# EAGLE design RH020.1 (EAGLE 7.1.0)
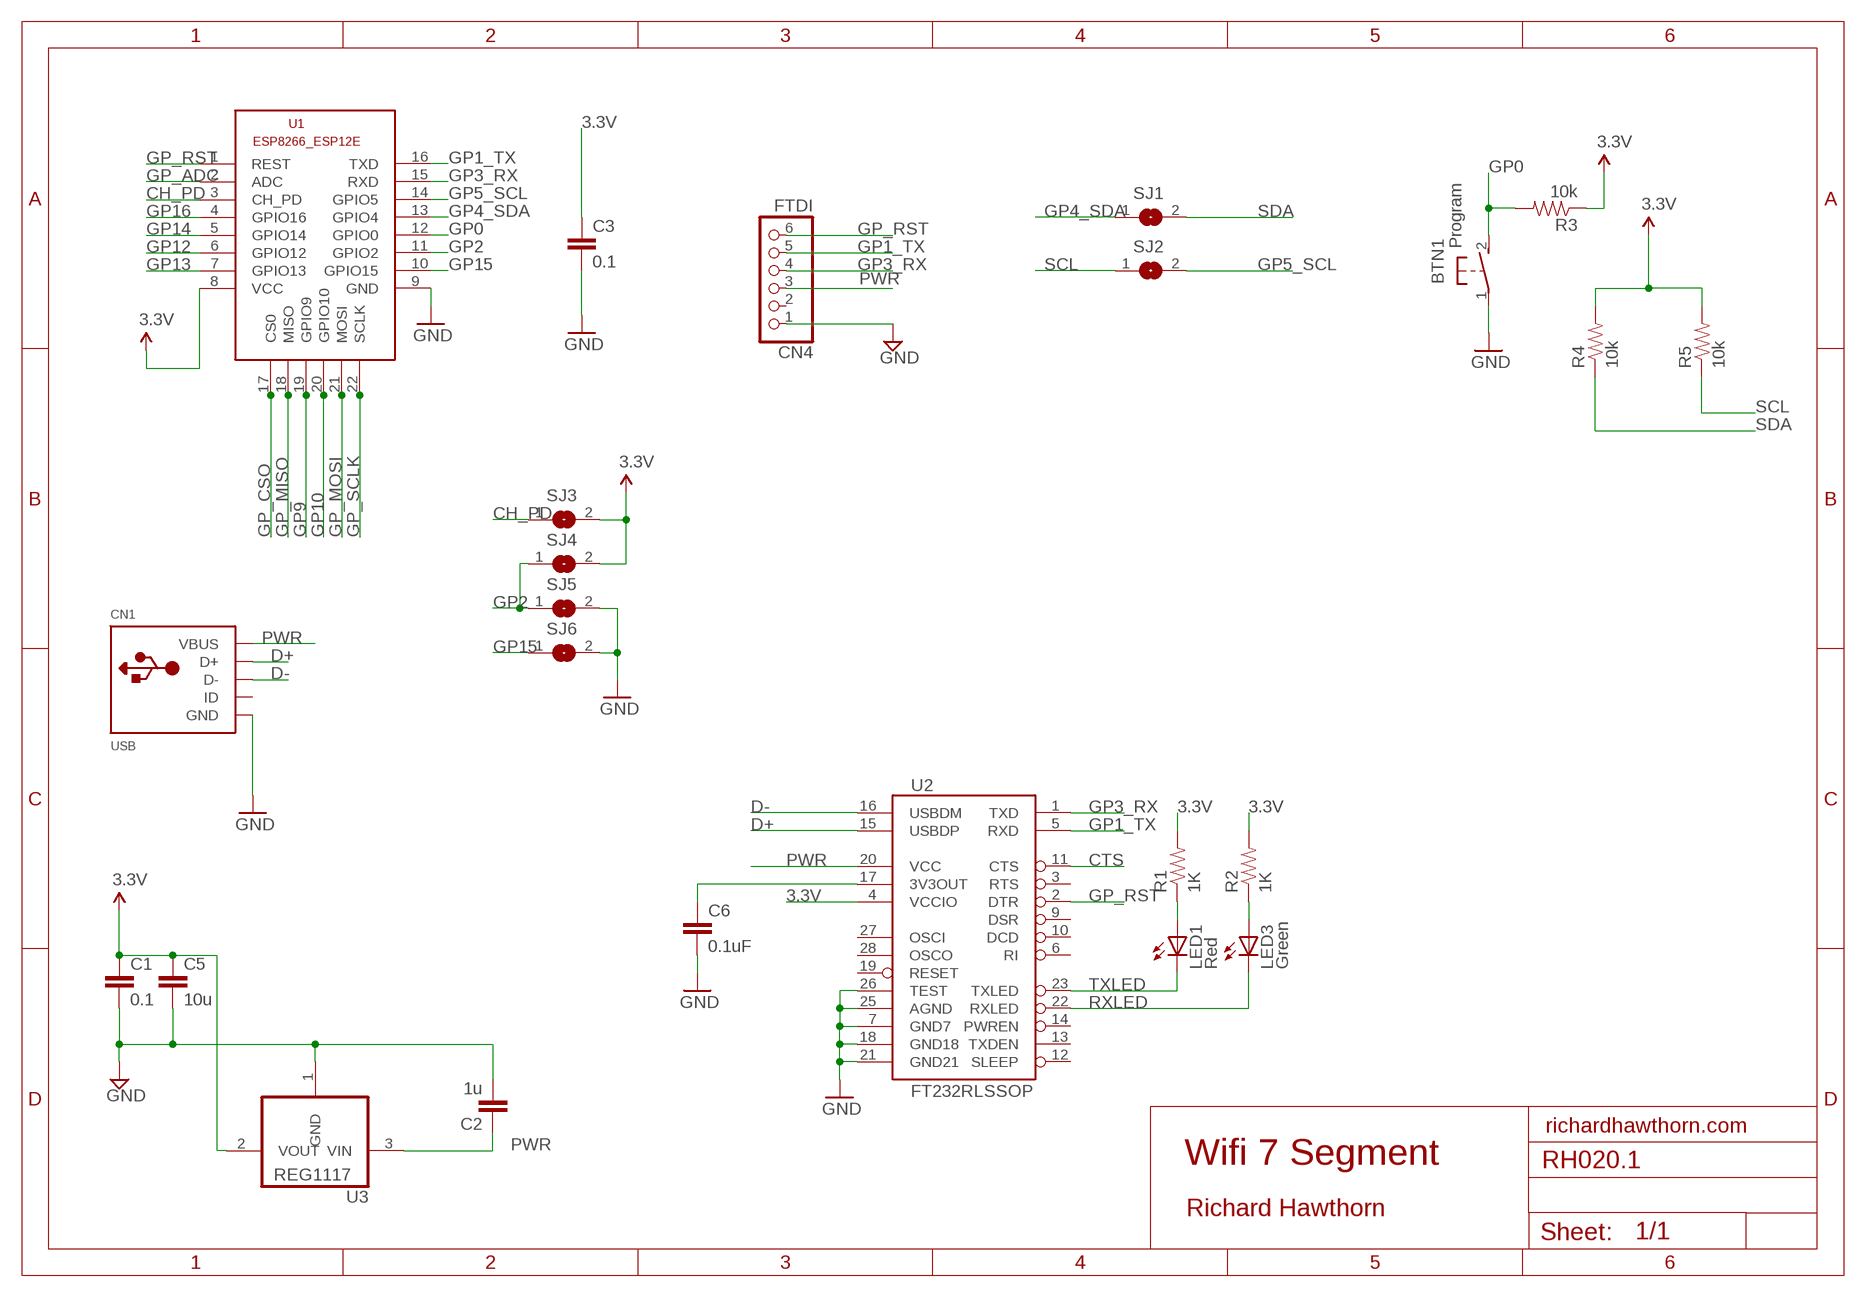
[diagram p0: schematic, sheet 1, part 1 of 2]
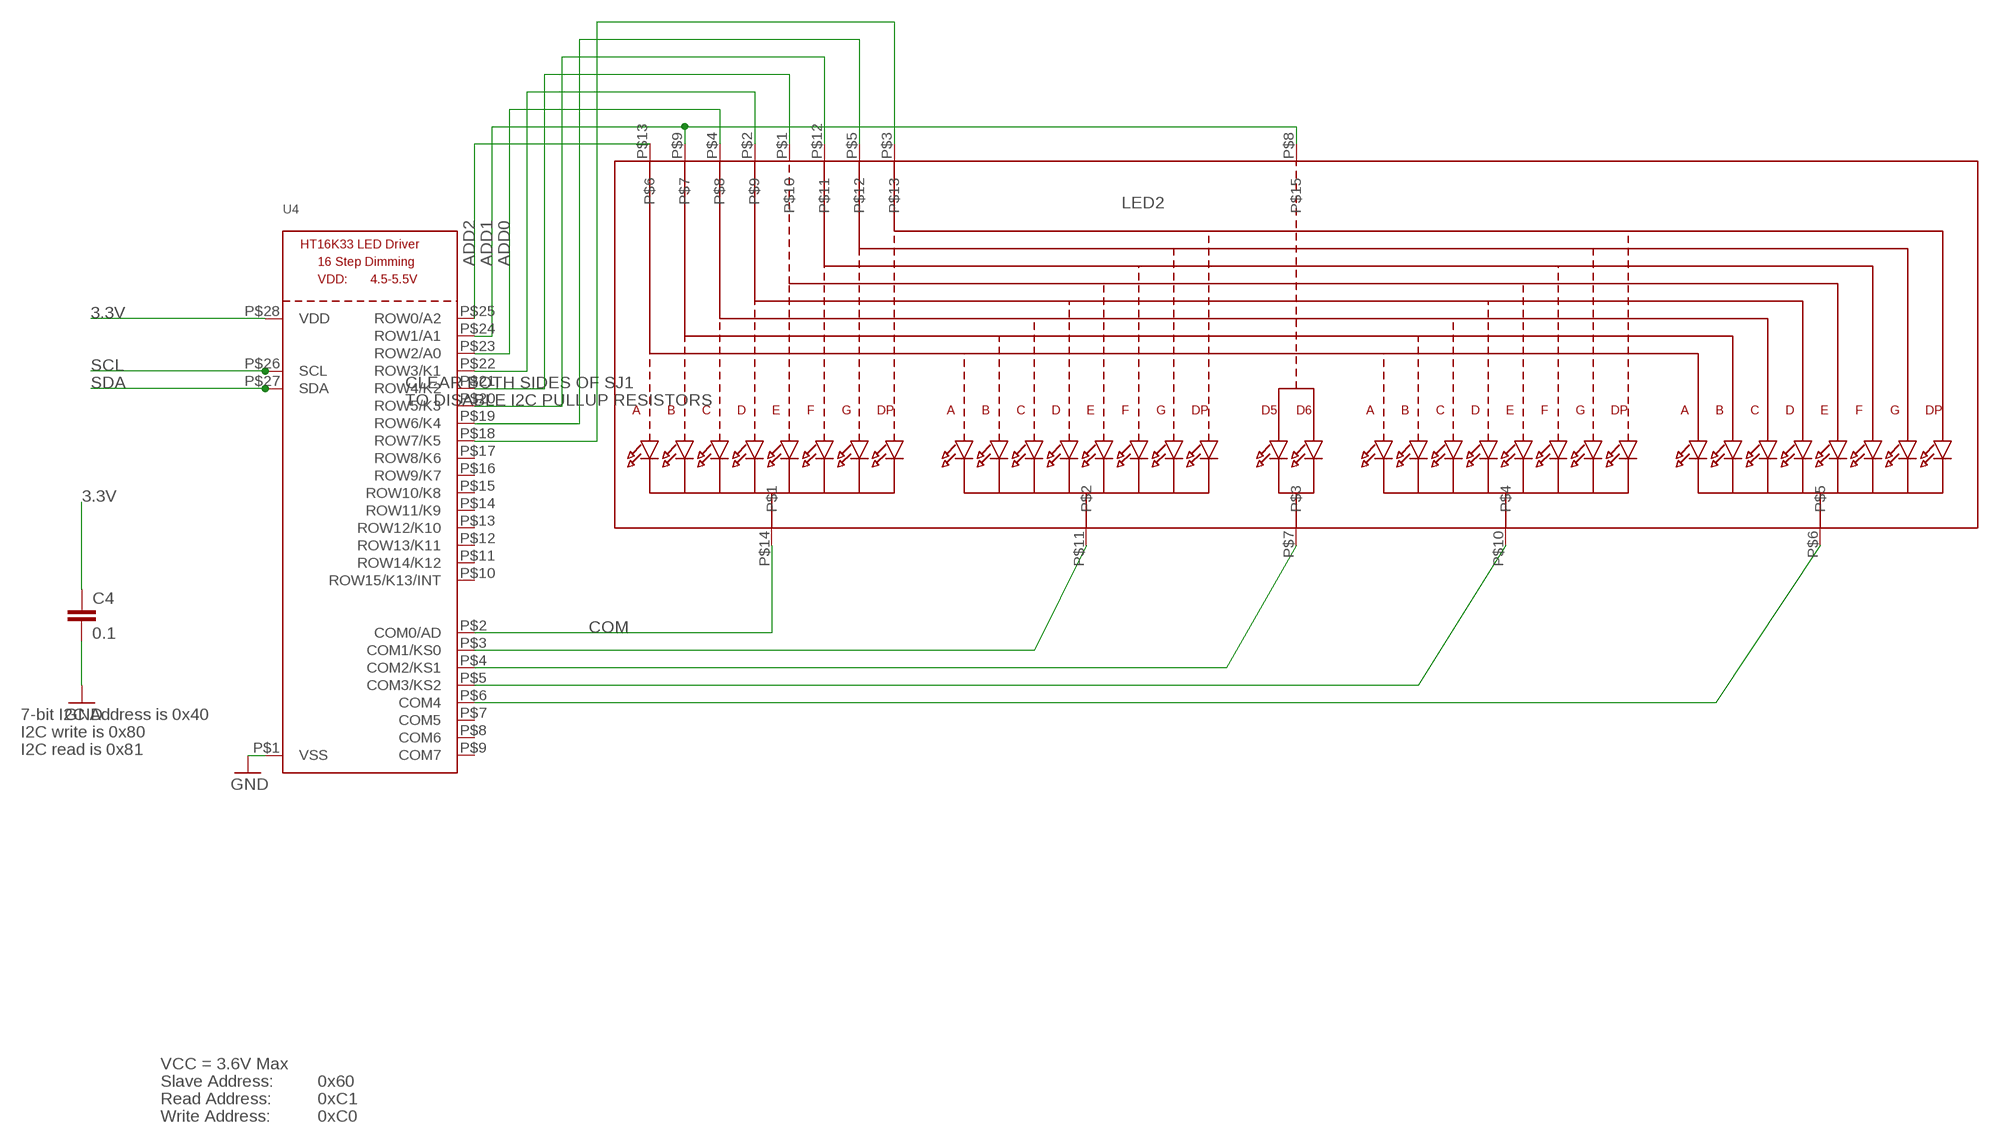
[diagram p1: schematic, sheet 1, part 2 of 2]

## Parts
BTN1  Program  DTS-3  [DTS-3]
C1  0.1  CAP0603-CAP  [0603-CAP]
C2  1u  CAP0603-CAP  [0603-CAP]
C3  0.1  CAP0603-CAP  [0603-CAP]
C4  0.1  CAP0603-CAP  [0603-CAP]
C5  10u  CAP0805-CAP  [0805-CAP]
C6  0.1uF  CAP0402-CAP  [0402-CAP]
CN1  USB  USBMINIB  [USB-MINIB]
CN4  FTDI  PINHD-1X6  [1X06]
LED1  Red  LED0603  [LED-0603]
LED2  DISP_SEGMENT_4DIGIT_BL-Q56C43  [SEGMENT-BL-Q56C43]
LED3  Green  LED0603  [LED-0603]
R1  1K  RESISTOR0402-RES  [0402-RES]
R2  1K  RESISTOR0402-RES  [0402-RES]
R3  10k  RESISTOR0805-RES  [0805]
R4  10k  RESISTOR0805-RES  [0805]
R5  10k  RESISTOR0805-RES  [0805]
SJ1  SJ  [SJ]
SJ2  SJ  [SJ]
SJ3  SJ  [SJ]
SJ4  SJ  [SJ]
SJ5  SJ  [SJ]
SJ6  SJ  [SJ]
U1  ESP8266-12EESP8266-ESP12E  [ESP8266-ESP12E]
U2  FT232RLSSOP  [SSOP28DB]
U3  REG1117  [SOT223]
U4  HT16K33_SOP28  [SOP28_300MIL]

## Nets
3.3V: C1.1 C3.1 C4.1 C5.1 R1.2 R2.2 R3.1 R4.2 R5.2 SJ3.2 SJ4.2 U1.8(VCC) U2.4(VCCIO) U3.2(VOUT) U4.P$28(VDD)
3.3VOUT: C6.1 U2.17(3V3OUT)
ADD0: LED2.P$4 U4.P$23(ROW2/A0)
ADD1: LED2.P$8 LED2.P$9 U4.P$24(ROW1/A1)
ADD2: LED2.P$13 U4.P$25(ROW0/A2)
CH_PD: SJ3.1 U1.3(CH_PD)
COM: LED2.P$14 U4.P$2(COM0/AD)
CTS: U2.11(CTS)
D+: CN1.D+ U2.15(USBDP)
D-: CN1.D- U2.16(USBDM)
GND [power]: BTN1.1 C1.2 C2.2 C3.2 C4.2 C5.2 C6.2 CN1.GND CN4.1 SJ5.2 SJ6.2 U1.9(GND) U2.7(GND7) U2.18(GND18) U2.21(GND21) U2.25(AGND) U2.26(TEST) U3.1(GND) U4.P$1(VSS)
GP0: BTN1.2 R3.2 U1.12(GPIO0)
GP1_TX: CN4.5 U1.16(TXD) U2.5(RXD)
GP2: SJ4.1 SJ5.1 U1.11(GPIO2)
GP3_RX: CN4.4 U1.15(RXD) U2.1(TXD)
GP4_SDA: SJ1.1 U1.13(GPIO4)
GP5_SCL: SJ2.2 U1.14(GPIO5)
GP9: U1.19(GPIO9)
GP10: U1.20(GPIO10)
GP12: U1.6(GPIO12)
GP13: U1.7(GPIO13)
GP14: U1.5(GPIO14)
GP15: SJ6.1 U1.10(GPIO15)
GP16: U1.4(GPIO16)
GP_ADC: U1.2(ADC)
GP_CSO: U1.17(CS0)
GP_MISO: U1.18(MISO)
GP_MOSI: U1.21(MOSI)
GP_RST: CN4.6 U1.1(REST) U2.2(DTR)
GP_SCLK: U1.22(SCLK)
N$2: LED1.A R1.1
N$3: LED3.A R2.1
N$7: LED2.P$11 U4.P$3(COM1/KS0)
N$8: LED2.P$7 U4.P$4(COM2/KS1)
N$9: LED2.P$10 U4.P$5(COM3/KS2)
N$10: LED2.P$6 U4.P$6(COM4)
N$11: LED2.P$2 U4.P$22(ROW3/K1)
N$12: LED2.P$1 U4.P$21(ROW4/K2)
N$13: LED2.P$12 U4.P$20(ROW5/K3)
N$15: LED2.P$5 U4.P$19(ROW6/K4)
N$16: LED2.P$3 U4.P$18(ROW7/K5)
PWR [power]: C2.1 CN1.VBUS CN4.3 U2.20(VCC) U3.3(VIN)
RXLED: LED3.C U2.22(RXLED)
SCL: R5.1 SJ2.1 U4.P$26(SCL)
SDA: R4.1 SJ1.2 U4.P$27(SDA)
TXLED: LED1.C U2.23(TXLED)
Unconnected: CN1.ID CN4.2 U2.3(RTS) U2.6(RI) U2.9(DSR) U2.10(DCD) U2.12(SLEEP) U2.13(TXDEN) U2.14(PWREN) U2.19(RESET) U2.27(OSCI) U2.28(OSCO) U4.P$7(COM5) U4.P$8(COM6) U4.P$9(COM7) U4.P$10(ROW15/K13/INT) U4.P$11(ROW14/K12) U4.P$12(ROW13/K11) U4.P$13(ROW12/K10) U4.P$14(ROW11/K9) U4.P$15(ROW10/K8) U4.P$16(ROW9/K7) U4.P$17(ROW8/K6)

## Notes on the sheet
- CLEAR BOTH SIDES OF SJ1
- TO DISABLE I2C PULLUP RESISTORS
- 7-bit I2C Address is 0x40
- I2C write is 0x80
- I2C read is 0x81
- richardhawthorn.com
- Wifi 7 Segment
- Richard Hawthorn
- VCC = 3.6V Max
- Slave Address: | 0x60
- Read Address: | 0xC1
- Write Address: | 0xC0

## Library data of the parts
BTN1 = switch-tact:DTS-3
C1-C5 = LowPowerLab:CAP: Capacitor Standard 0603 ceramic capacitor, and 0.1" leaded capacitor.
C6 = SparkFun:CAP: Capacitor Standard 0603 ceramic capacitor, and 0.1" leaded capacitor.
CN1 = LowPowerLab:USB: USB Connectors USBMINIB - Surface Mount Female Mini-B USB Connector 4UConnector: 06564 By microbuilder.eu Thru-hole RA Female Mini-B USB Connector 4UConnector: 18732 By ladyada.net
CN4 = pinhead:PINHD-1X6: PIN HEADER
LED1 LED3 = SparkFun:LED: LEDs Standard schematic elements and footprints for 5mm, 3mm, 1206, and 0603 sized LEDs. 5mm - Spark Fun Electronics SKU : COM-00529 (and others)
LED2 = microbuilder:DISP_SEGMENT_4DIGIT_BL-Q56C43
R1-R5 = SparkFun:RESISTOR: Resistor Basic schematic elements and footprints for 0603, 1206, and PTH resistors.
SJ1-SJ6 = jumper:SJ: SMD solder JUMPER
U1 = ESP8266-ESP12E:ESP8266-12E: ESP8266-12E with additional I/O and GPIO04/05 corrected The author cannot warrant that this library is free from error or will meet your specific requirements. Created by PuceBaboon.com. Komagane, Nagano, JAPAN
U2 = SparkFun:FT232RL: USB UART FT232RL 4th Generation USB UART (USB <-> Serial) Controller. Spark Fun Electronics SKU : COM-00650
U3 = burr-brown:REG1117: 800mA and 1A Low Dropout (LDO) Positive Regulator 1.8V, 2.5V, 2.85V, 3.3V, 5V, and Adj; MPN: REG1117; OC_FARNELL: 1097566; OC_NEWARK: 14P6981
U4 = microbuilder:HT16K33_SOP28

## Net classes
1 power: width 0.381 mm, clearance 0.254 mm

## Board
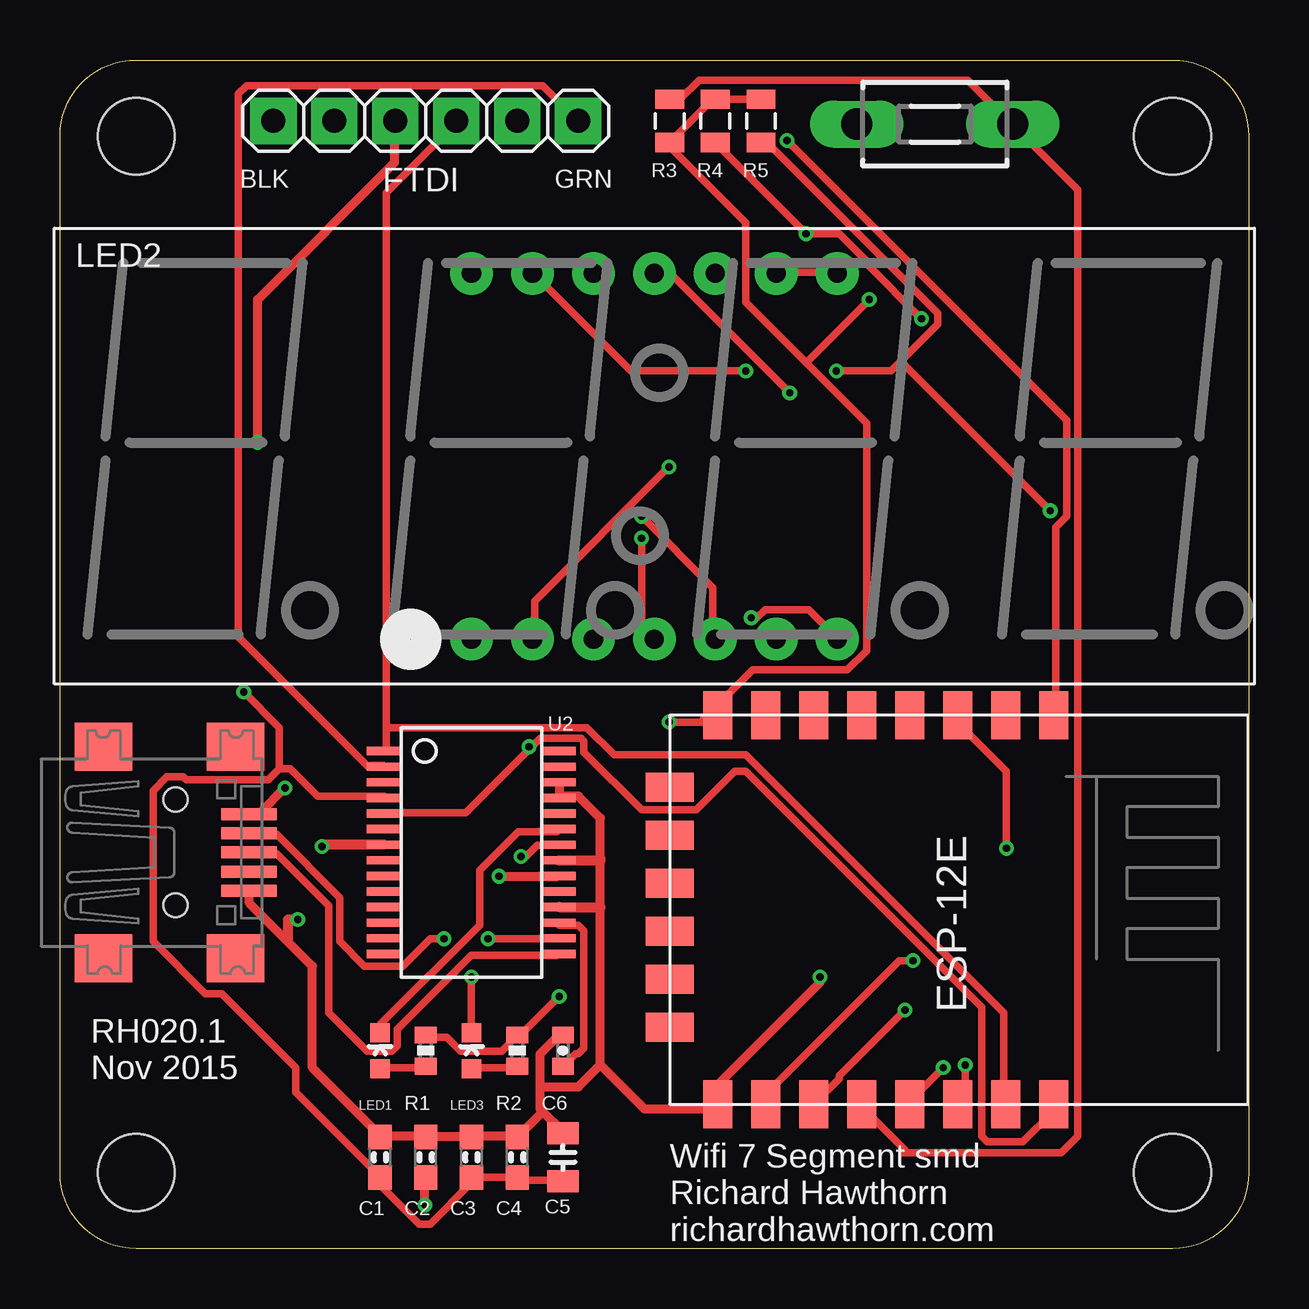
[diagram p2: board, top side]
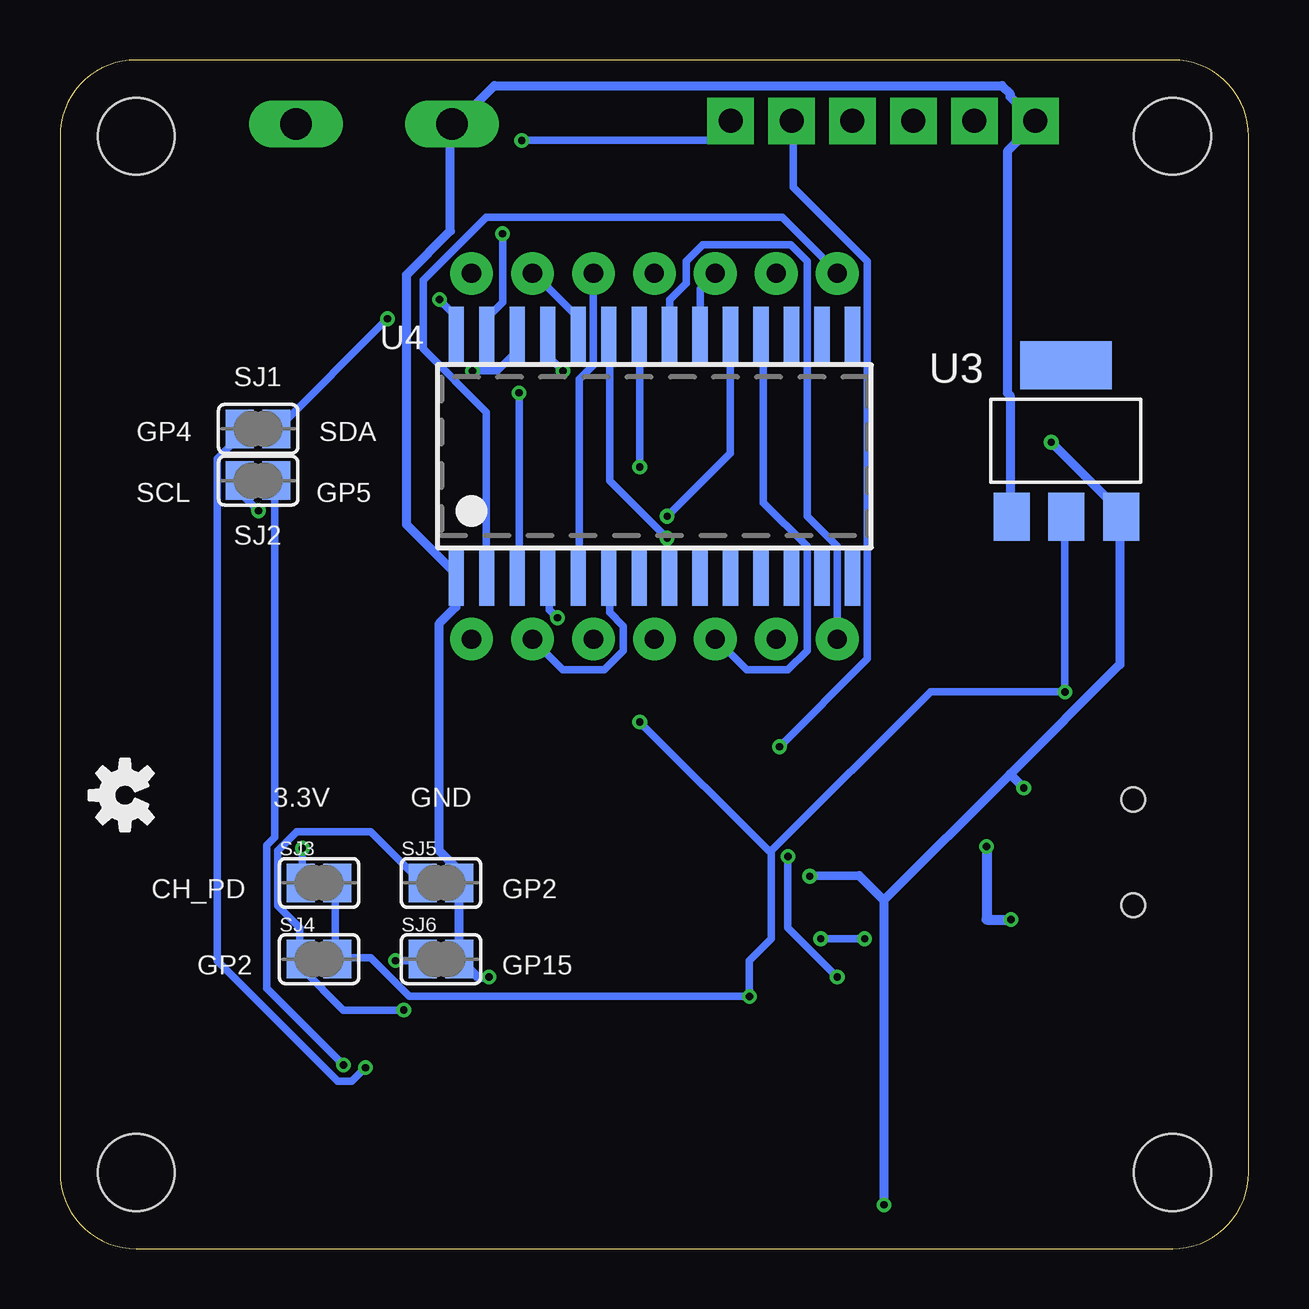
[diagram p3: board, bottom side, seen from below]

Size 49.53 x 49.53 mm. Coordinates in mm from the lower left corner, seen from the top.
Outline: 0,3.17 0,46.35 arc-90 3.17,49.53 46.35,49.53 arc-90 49.53,46.35 49.53,3.17 arc-90 46.35,0 3.17,0 arc-90 0,3.17
Copper layers (1*16): Top 0.035mm / dielectric 1.5mm / Bottom 0.035mm
Design rules "ITEADstudio_DRC *": minimum track width 12mil, minimum drill 12mil, track to track 6mil, track to pad 6mil, pad to pad 6mil, via to via 6mil, smd to smd 0mil, copper to edge 10mil, drill to drill 10mil, minimum pad ring 10mil, minimum via ring 6mil, stop-mask expansion 2mil, vias tented up to drill 100mil, thermal gap 15mil
Holes 3.2 mm at 3.17,3.17 46.35,3.17 3.17,46.35 46.35,46.35
tKeepout: area 0,0 to 5.7,5.7; area 43.8,0 to 49.5,5.7; area 43.8,43.8 to 49.5,49.5; area 0,43.8 to 5.7,49.5
bKeepout: area 0,43.8 to 5.7,49.5; area 43.8,43.8 to 49.5,49.5; area 43.8,0 to 49.5,5.7; area 0,0 to 5.7,5.7
tRestrict: area 24.3,8.9 to 29.1,12.8; area 5.8,16.9 to 6.9,18.5; area 5.2,9.7 to 6.7,10.4
bRestrict: area 27.4,17.7 to 29.2,18.7; area 21.1,13.8 to 22.9,14.9; area 21.6,12.6 to 22.1,13.2; area 20.7,12.6 to 21.2,13.2; area 20.2,12.8 to 20.7,13.5; area 20.1,13.4 to 20.6,14; area 26.5,18.9 to 27.1,19.5; area 26.5,17.9 to 27.1,18.5; area 27.5,19.1 to 28,19.8; area 27.9,18.8 to 29.1,19.6

### Footprints (pad centres in the part's own frame; a part is rotated, then mirrored left to right if it is on the bottom)
DTS-3 = drill 1.3 long: 1 -3.25,0; 2 3.25,0
0603-CAP = smd 1.016 x 0.965: 1 -0.85,0; 2 0.85,0
0805-CAP = smd 0.902 x 1.3: 1 -1,0; 2 1,0
0402-CAP = smd 0.7 x 0.9: 1 -0.65,0; 2 0.65,0
USB-MINIB = smd 0.5 x 2.308: D+ 0,4.064; D- -0.8,4.064; GND 1.6,4.064; ID 0.8,4.064; VBUS -1.6,4.064 | smd 2 x 2.4: GND1 -4.4,-2; GND2 -4.4,3.5; GND3 4.4,3.5; GND4 4.4,-2 | hole 1: -2.2,1; 2.2,1
1X06 = drill 1 pad 1.93 square: 1 -6.35,0; 2 -3.81,0; 3 -1.27,0; 4 1.27,0; 5 3.81,0; 6 6.35,0
LED-0603 = smd 0.8 x 0.8: A 0,-0.75; C 0,0.75
SEGMENT-BL-Q56C43 = drill 0.8 pad 1.778: P$1 -7.62,-7.62; P$2 -5.08,-7.62; P$3 -2.54,-7.62; P$4 0,-7.62; P$5 2.54,-7.62; P$6 5.08,-7.62; P$7 7.62,-7.62; P$8 7.62,7.62; P$9 5.08,7.62; P$10 2.54,7.62; P$11 0,7.62; P$12 -2.54,7.62; P$13 -5.08,7.62; P$14 -7.62,7.62
0402-RES = smd 0.7 x 0.9: 1 -0.65,0; 2 0.65,0
0805 = smd 0.8 x 1.2: 1 -0.9,0; 2 0.9,0
SJ = smd 1.168 x 1.6: 1 -0.762,0; 2 0.762,0
ESP8266-ESP12E = smd 2 x 1.2: 1 0,16; 2 0,14; 3 0,12; 4 0,10; 5 0,8; 6 0,6; 7 0,4; 8 0,2; 9 16.2,2; 10 16.2,4; 11 16.2,6; 12 16.2,8; 13 16.2,10; 14 16.2,12; 15 16.2,14; 16 16.2,16 | smd 1.2 x 2: 17 11,0; 18 3,0; 19 5,0; 20 13,0; 21 7,0; 22 9,0
SSOP28DB = smd 0.348 x 1.397: 1 -4.225,-3.656; 2 -3.575,-3.656; 3 -2.925,-3.656; 4 -2.275,-3.656; 5 -1.625,-3.656; 6 -0.975,-3.656; 7 -0.325,-3.656; 8 0.325,-3.656; 9 0.975,-3.656; 10 1.625,-3.656; 11 2.275,-3.656; 12 2.925,-3.656; 13 3.575,-3.656; 14 4.225,-3.656; 15 4.225,3.656; 16 3.575,3.656; 17 2.925,3.656; 18 2.275,3.656; 19 1.625,3.656; 20 0.975,3.656; 21 0.325,3.656; 22 -0.325,3.656; 23 -0.975,3.656; 24 -1.625,3.656; 25 -2.275,3.656; 26 -2.925,3.656; 27 -3.575,3.656; 28 -4.225,3.656
SOT223 = smd 1.499 x 2.007: 1 -2.261,-3.15; 2 0.025,-3.15; 3 2.311,-3.15 | smd 3.81 x 2.007: 4 0,3.15
SOP28_300MIL = smd 0.635 x 2.286: P$1 -8.255,-5.08; P$2 -6.985,-5.08; P$3 -5.715,-5.08; P$4 -4.445,-5.08; P$5 -3.175,-5.08; P$6 -1.905,-5.08; P$7 -0.635,-5.08; P$8 0.635,-5.08; P$9 1.905,-5.08; P$10 3.175,-5.08; P$11 4.445,-5.08; P$12 5.715,-5.08; P$13 6.985,-5.08; P$14 8.255,-5.08; P$15 8.255,5.08; P$16 6.985,5.08; P$17 5.715,5.08; P$18 4.445,5.08; P$19 3.175,5.08; P$20 1.905,5.08; P$21 0.635,5.08; P$22 -0.635,5.08; P$23 -1.905,5.08; P$24 -3.175,5.08; P$25 -4.445,5.08; P$26 -5.715,5.08; P$27 -6.985,5.08; P$28 -8.255,5.08

### Placement (x,y rotation side)
BTN1  36.45,46.86 0 top
C1  13.34,3.81 90 top
C2  15.24,3.81 90 top
C3  17.14,3.81 90 top
C4  19.05,3.81 90 top
C5  20.95,3.81 90 top
C6  20.95,8.26 90 top
CN1  3.81,16.51 270 top
CN4  15.24,46.99 0 top
LED1  13.34,8.26 0 top
LED2  24.77,33.02 0 top
LED3  17.14,8.26 0 top
R1  15.24,8.26 90 top
R2  19.05,8.26 90 top
R3  25.4,46.99 90 top
R4  27.3,46.99 90 top
R5  29.21,46.99 90 top
SJ1  41.27,34.16 0 bottom
SJ2  41.27,32 0 bottom
SJ3  38.73,15.24 0 bottom
SJ4  38.73,12.06 0 bottom
SJ5  33.66,15.24 0 bottom
SJ6  33.66,12.06 0 bottom
U1  25.4,22.23 270 top
U2  17.14,16.51 270 top
U3  7.62,33.66 0 bottom
U4  24.77,33.02 0 bottom
U$3  [OSHW-LOGO-S]  46.82,18.9 90 bottom

### Tracks (layer width: path | path; a pad name or v marks a point on that pad's centre or on a via)
3.3V  (via drill 0.3)
  Top 0.305: R5.2 29.15,47.89 27.43,47.89 R4.2 27.2,47.89 25.49,46.18 R3.1 25.38,45.95 28.57,42.75 28.57,39.43 31.09,36.92 | 31.09,36.92 33.6,34.4 33.6,24.92 32.8,24.12 28.85,24.12 26.8,22.06 U1.8 27.32,21.95 v25.38,21.95 | 31.09,36.92 v33.72,39.55 | R1.2 15.32,8.8 16.12,8.8 16.69,8.23 18.4,8.23 18.97,8.8 R2.2 19.2,8.91 v20.8,10.52 | C5.1 20.92,2.86 19.09,2.86 C4.1 18.97,2.97 17.26,2.97 C3.1 17.14,2.74 15.43,1.03 14.97,1.03 13.37,2.63 13.37,2.86 C1.1 13.26,3.09 9.83,6.51 9.83,7.54 6.74,10.63 6.06,10.63 3.89,12.8 3.89,19.09 4.46,19.66 5.14,19.66 5.26,19.55 8.69,19.55 9.14,20 | 9.14,20 9.6,20 10.74,18.86 13.49,18.86 U2.4 | v7.66,23.2 9.14,21.72 9.14,20
  Bottom 0.305: v33.72,39.55 33.03,38.86 33.03,38.18 U4.P$28 | SJ3.2 38.06,15.2 38.06,12.12 SJ4.2 37.83,12.12 36.58,12.12 34.98,10.52 v20.8,10.52 20.8,12 19.89,12.92 19.89,16.57 | U3.2 7.66,30.4 v7.66,23.2 13.26,23.2 19.89,16.57 | v25.38,21.95 20,16.57 19.89,16.57
3.3VOUT
  Top 0.305: C6.1 21.03,7.66 21.49,8.12 21.6,8.12 21.83,8.34 21.83,13.26 21.6,13.49 20.8,13.49 U2.17
ADD0  (via drill 0.3)
  Top 0.305: v24.23,29.6 24.23,25.95 24.69,25.49 LED2.P$4
  Bottom 0.305: v24.23,29.6 26.63,32 26.63,38.06 U4.P$23
ADD1
  Top 0.305: LED2.P$8 32.35,40.69 29.95,40.69 LED2.P$9
  Bottom 0.305: U4.P$24 28,38.18 28,38.86 29.83,40.69 LED2.P$9
ADD2  (via drill 0.3)
  Top 0.305: v28.57,36.58 23.77,36.58 19.77,40.58 LED2.P$13
  Bottom 0.305: v28.57,36.58 29.15,37.15 29.15,38.06 U4.P$25
CH_PD  (via drill 0.3)
  Top 0.305: v39.43,16.69 39.43,19.89 37.38,21.95 U1.3
  Bottom 0.305: v39.43,16.69 39.43,15.32 SJ3.1
COM
  Bottom 0.305: U4.P$2 31.77,28 31.77,34.86 34.4,37.49 34.4,40.35 31.77,42.98 19.43,42.98 17.14,40.69 LED2.P$14
D+
  Top 0.305: U2.15 20.69,12.23 17.14,12.23 14.06,9.14 14.06,8.46 13.83,8.23 12.8,8.23 11.2,9.83 11.2,14.29 9.03,16.46 7.89,16.46 CN1.D+
D-  (via drill 0.3)
  Top 0.305: v17.83,12.92 20.69,12.92 U2.16 | v16,12.92 15.43,12.92 14.29,11.77 12.69,11.77 11.66,12.8 11.66,14.63 9.03,17.26 7.89,17.26 CN1.D-
  Bottom 0.305: v16,12.92 v17.83,12.92
GND  (via drill 0.3)
  Top 0.381: U2.26 20.8,18.86 U2.25 20.92,18.86 21.6,18.86 22.52,17.95 22.52,16.26 22.52,14.22 22.52,7.66 | 20,6.74 20,5.83 20.12,5.71 | 20,6.74 20,8.12 20.69,8.8 20.92,8.8 C6.2 | 20.12,5.71 20.92,4.92 C5.2 | 20.12,5.71 19.09,4.69 C4.2 18.97,4.69 17.26,4.69 C3.2 17.14,4.69 15.32,4.69 C2.2 15.2,4.69 13.37,4.69 C1.2 13.26,4.8 10.52,7.54 10.52,11.77 9.49,12.79 7.89,14.4 7.89,14.86 CN1.GND | 22.52,7.66 21.6,6.74 20,6.74 | 22.52,7.66 24.35,5.83 27.32,5.83 U1.9 | 27.43,6.86 27.43,5.94 U1.9 | v31.66,11.32 31.66,11.09 27.55,6.97 U1.9
  Top 0.406: U2.21 22.52,16.18 22.52,16.26 | U2.18 22.52,14.23 22.52,14.22 | U2.7 10.92,16.84 v10.92,16.76 | v9.91,13.72 9.49,13.72 9.49,12.79
  Bottom 0.381: U3.1 9.94,30.52 9.94,35.55 10.06,35.66 10.06,45.72 8.8,46.98 CN4.1 9.03,47.09 9.94,48.01 9.94,48.12 10.29,48.46 31.43,48.46 33.03,46.86 BTN1.1 33.26,46.86 33.26,42.41 35.09,40.58 35.09,30.18 33.03,28.12 U4.P$1 33.03,27.89 33.03,26.75 33.72,26.06 33.72,16.57 33.03,15.89 33.03,15.32 SJ5.2 32.92,15.2 32.92,12.12 SJ6.2 32.8,12 32.12,11.32 v31.66,11.32
  Bottom 0.406: v10.92,16.76 10.92,13.72 v9.91,13.72
GP0
  Top 0.305: R3.2 25.49,47.89 25.83,47.89 26.63,48.69 37.83,48.69 39.66,46.86 BTN1.2 39.78,46.75 42.41,44.12 42.41,4.69 41.72,4 35.2,4 | 35.2,4 35.09,4 | 33.49,5.71 U1.12 33.6,5.71 35.2,4.12 35.2,4
GP1_TX  (via drill 0.3)
  Top 0.305: 19.6,20.86 20,21.26 21.72,21.26 21.83,21.14 21.83,20.69 24.23,18.29 26.52,18.29 28.12,19.89 28.57,19.89 38.41,10.06 38.41,4.69 38.63,4.46 40.12,4.46 41.38,5.71 U1.16 | 19.6,20.86 16.92,18.17 13.6,18.17 U2.5 | v19.55,20.92 19.6,20.86
  Bottom 0.305: v19.55,20.92 15.89,24.57 15.89,41.15 18.97,44.23 18.97,46.98 CN4.5
GP2  (via drill 0.3)
  Top 0.305: v35.2,9.94 32.46,7.2 32.46,7.09 31.43,6.06 U1.11
  Bottom 0.305: SJ5.1 34.52,15.32 36.58,17.37 39.66,17.37 40.46,16.57 40.46,14.29 39.55,13.37 39.55,12.12 SJ4.1 39.43,12 39.43,11.66 37.72,9.94 v35.2,9.94
GP3_RX
  Top 0.305: 13.6,21.72 13.6,44.01 16.57,46.98 CN4.4 | 13.6,21.72 13.6,20.8 U2.1 | 13.6,21.72 21.95,21.72 23.09,20.57 28.57,20.57 39.32,9.83 39.32,5.83 U1.15
GP4_SDA  (via drill 0.3)
  Top 0.305: v36.8,7.54 35.32,6.06 U1.13
  Bottom 0.305: v36.8,7.54 37.38,6.97 37.95,6.97 42.98,12 42.98,32.92 42.06,33.83 42.06,34.06 SJ1.1
GP5_SCL  (via drill 0.3)
  Top 0.305: v37.72,7.66 37.72,6.29 37.49,6.06 U1.14
  Bottom 0.305: v37.72,7.66 40.92,10.86 40.92,16.8 40.58,17.14 40.58,32 SJ2.2
GP15  (via drill 0.3)
  Top 0.305: 29.38,6.46 U1.10 29.49,6.51 34.98,12 v35.55,12
  Bottom 0.305: v35.55,12 34.52,12 SJ6.1
GP_RST  (via drill 0.3)
  Top 0.305: CN4.6 20.12,48.46 7.77,48.46 7.43,48.12 7.43,25.49 12.8,20.12 13.49,20.12 U2.2 | v30.29,46.18 41.95,34.52 41.95,30.52 41.49,30.06 41.49,22.06 U1.1
  Bottom 0.305: v30.29,46.18 22.4,46.18 CN4.6
N$2
  Top 0.305: LED1.A 13.37,7.54 15.2,7.54 R1.1
N$3
  Top 0.305: LED3.A 17.14,7.54 18.97,7.54 R2.1
N$7  (via drill 0.3)
  Top 0.305: v30.4,35.66 25.49,40.58 24.8,40.58 LED2.P$11
  Bottom 0.305: v30.4,35.66 30.4,28 U4.P$3
N$8  (via drill 0.3)
  Top 0.305: v28.8,26.29 29.03,26.29 29.38,26.63 31.2,26.63 32.35,25.49 LED2.P$7
  Bottom 0.305: v28.8,26.29 29.15,26.63 29.15,27.89 U4.P$4
N$9
  Bottom 0.305: U4.P$5 27.89,28 27.89,36.23 27.32,36.8 27.32,40.58 LED2.P$10
N$10
  Bottom 0.305: U4.P$6 26.63,27.89 26.63,26.52 26.06,25.95 26.06,24.92 26.86,24.12 28.57,24.12 29.83,25.38 LED2.P$6
N$11  (via drill 0.3)
  Top 0.305: v25.38,32.58 19.77,26.98 19.77,25.49 LED2.P$2
  Bottom 0.305: v25.38,32.58 25.38,38.06 U4.P$22
N$12
  Bottom 0.305: LED2.P$1 17.14,29.26 18.4,30.52 18.4,41.15 19.09,41.83 22.75,41.83 23.43,41.15 23.43,40.23 24.12,39.55 24.12,38.18 U4.P$21
N$13
  Bottom 0.305: U4.P$20 22.86,40.01 LED2.P$12
N$15  (via drill 0.3)
  Top 0.305: v24.23,30.52 27.2,27.55 27.2,25.49 LED2.P$5
  Bottom 0.305: v24.23,30.52 21.6,33.15 21.6,38.06 U4.P$19
N$16
  Bottom 0.305: U4.P$18 20.23,38.06 20.23,31.09 18.4,29.26 18.4,24.92 19.2,24.12 20.92,24.12 22.17,25.38 LED2.P$3
PWR  (via drill 0.3)
  Top 0.381: v15.2,1.83 15.2,2.86 C2.1 | v18.29,15.52 20.69,15.52 U2.20 | v9.37,19.2 8.34,18.17 7.89,18.17 CN1.VBUS | v8.23,33.6 8.23,39.55 13.95,45.26 13.95,46.98 CN4.3
  Bottom 0.381: 15.2,14.52 v15.2,1.83 | 9.94,19.77 5.37,24.35 5.37,30.4 U3.3 5.26,30.63 v8.23,33.6 | 9.94,19.77 15.2,14.52 | v18.29,15.52 16.23,15.54 15.2,14.52 | 9.94,19.77 v9.37,19.2
RXLED  (via drill 0.3)
  Top 0.305: v17.14,11.32 LED3.C | v19.2,16.34 19.43,16.34 19.89,16.8 20.69,16.8 U2.22
  Bottom 0.305: v17.14,11.32 19.2,13.37 v19.2,16.34
SCL  (via drill 0.3)
  Top 0.305: 35.03,36.98 34.63,36.58 v32.35,36.58 | 35.03,36.98 36.58,38.52 36.58,38.98 29.49,46.06 29.26,46.06 R5.1 | 35.03,36.98 v41.26,30.75
  Bottom 0.305: v32.35,36.58 31.32,36.58 30.52,37.38 30.52,38.06 U4.P$26 | v41.26,30.75 41.95,31.43 41.95,32 SJ2.1
SDA  (via drill 0.3)
  Top 0.305: R4.1 27.32,46.06 v31.09,42.29 32.46,42.29 33.6,41.15 33.6,41.03 v35.89,38.75
  Bottom 0.305: v31.09,42.29 31.09,39.43 31.66,38.86 31.66,38.18 U4.P$27 | v35.89,38.75 40.46,34.18 SJ1.2
TXLED
  Top 0.305: LED1.C 13.37,9.03 13.37,9.37 17.49,13.49 17.49,15.77 19.09,17.37 20.69,17.37 U2.23

### Text on the board
tNames: FTDI | BLK | GRN | RH020.1 / Nov 2015 | Wifi 7 Segment smd / Richard Hawthorn / richardhawthorn.com
bNames: SDA | GP4 | GP5 | SCL | GND | 3.3V | GP2 | CH_PD | GP15 | GP2
tDocu: REG